# Altium schematic sheet Controller.SchDoc
size A3
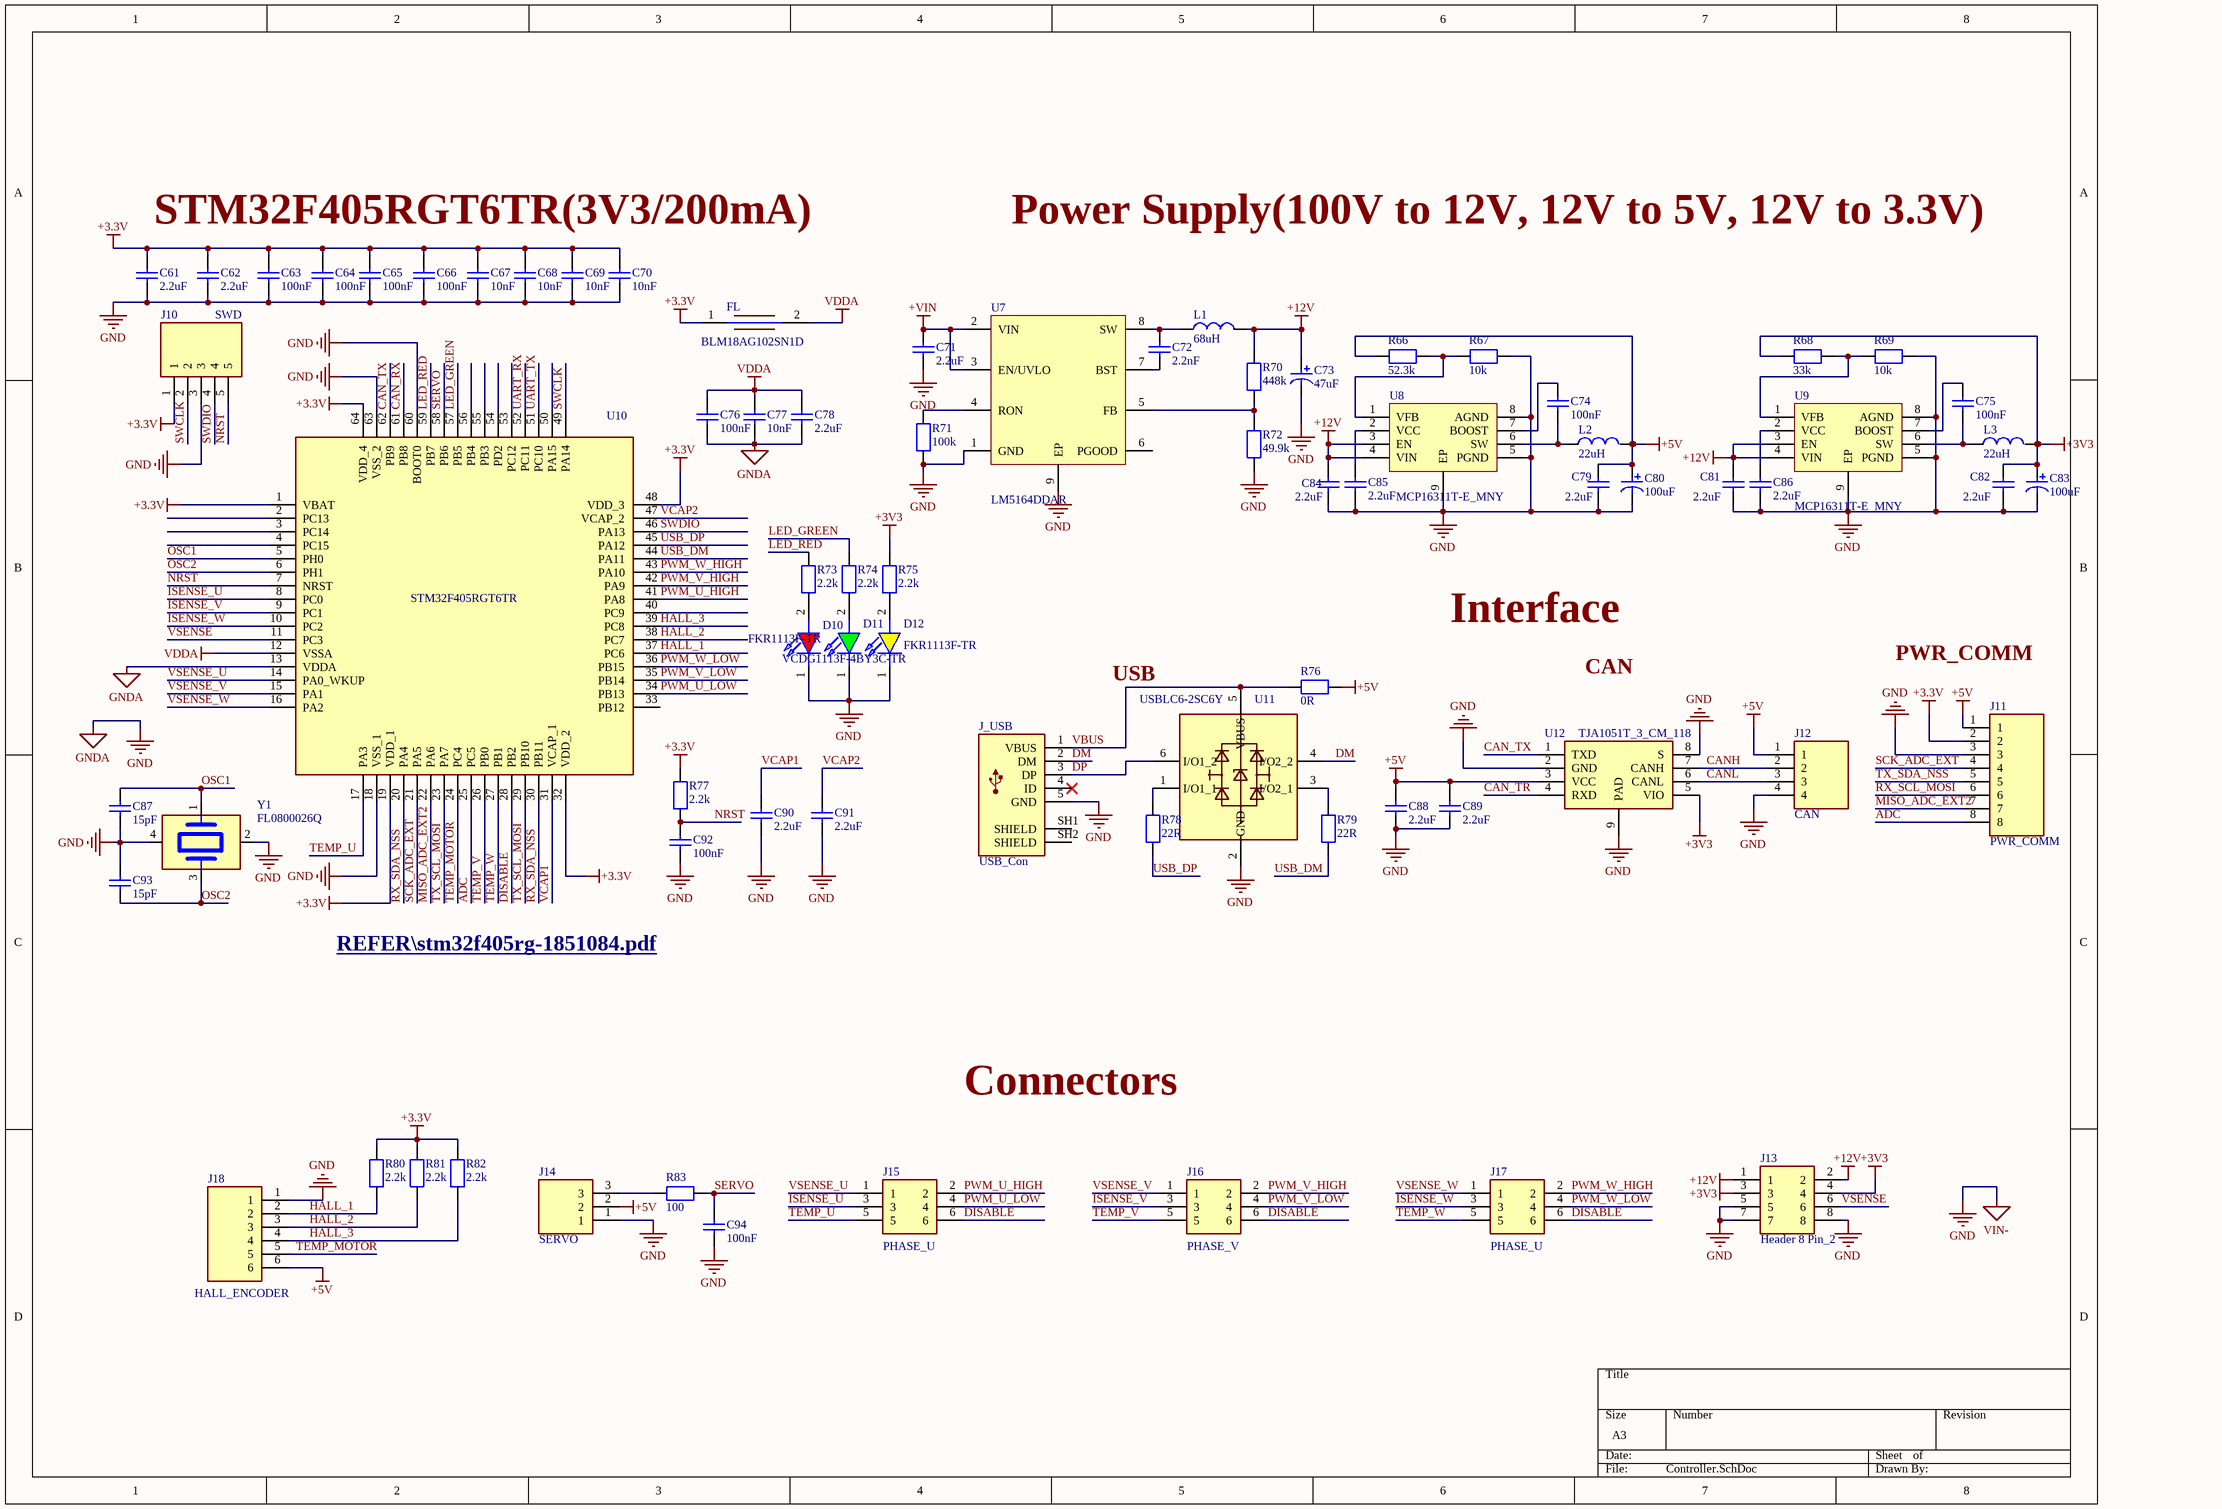
[diagram p0: Controller.SchDoc]

## Parts
C61  2.2uF  [C0603]
C62  2.2uF  [C0603]
C63  100nF  [C0402]
C64  100nF  [C0402]
C65  100nF  [C0402]
C66  100nF  [C0402]
C67  10nF  [C0402]
C68  10nF  [C0402]
C69  10nF  [C0402]
C70  10nF  [C0402]
C71  2.2uF  [C0603]
C72  2.2nF  [C0402]
C73  47uF  [CAPPRD200W52D500H1250]
C74  100nF  [C0402]
C75  100nF  [C0402]
C76  100nF  [C0402]
C77  10nF  [C0402]
C78  2.2uF  [C0603]
C79  2.2uF  [C0603]
C80  100uF  [CAPPRD225W50D680H1250]
C81  2.2uF  [C0603]
C82  2.2uF  [C0603]
C83  100uF  [CAPPRD225W50D680H1250]
C84  2.2uF  [C0603]
C85  2.2uF  [C0603]
C86  2.2uF  [C0603]
C87  15pF  [C0402]
C88  2.2uF  [C0603]
C89  2.2uF  [C0603]
C90  2.2uF  [C0603]
C91  2.2uF  [C0603]
C92  100nF  [C0402]
C93  15pF  [C0402]
C94  100nF  [C0402]
D10  FKR1113F-TR  [VCDG1113F4BY3CTR]
D11  VCDG1113F-4BY3C-TR  [VCDG1113F4BY3CTR]
D12  FKR1113F-TR  [VCDG1113F4BY3CTR]
FL  BLM18AG102SN1D  [BLM18EG121SH1D]
J10  SWD  [61300511121]
J11  PWR_COMM  [61301821121]
J12  CAN  [61300411121]
J13  Header 8 Pin_2  [61300821121]
J14  SERVO  [61300311121]
J15  PHASE_U  [61300621121]
J16  PHASE_V  [61300621121]
J17  PHASE_U  [61300621121]
J18  HALL_ENCODER  [61300611121]
J_USB  USB_Con  [10118194-0001LF]
L1  68uH  [INDPM7973X540N]
L2  22uH  [INDPM7973X540N]
L3  22uH  [INDPM7973X540N]
R66  52.3k  [R0603]
R67  10k  [R0603]
R68  33k  [R0603]
R69  10k  [R0603]
R70  448k  [R0603]
R71  100k  [R0603]
R72  49.9k  [R0603]
R73  2.2k  [R0603]
R74  2.2k  [R0603]
R75  2.2k  [R0603]
R76  0R  [R1206]
R77  2.2k  [R0603]
R78  22R  [R0603]
R79  22R  [R0603]
R80  2.2k  [R0603]
R81  2.2k  [R0603]
R82  2.2k  [R0603]
R83  100  [R0603]
U7  LM5164DDAR  [SOIC-8(EPAD)]
U8  MCP16311T-E_MNY  [MSOP-8]
U9  MCP16311T-E_MNY  [MSOP-8]
U10  STM32F405RGT6TR  [QFP50P1200X1200X160-64N]
U11  USBLC6-2SC6Y  [SOT95P280X145-6N]
U12  TJA1051T_3_CM_118  [SOIC127P600X175-8N]
Y1  FL0800026Q  [XTAL_FL0800026Q]

## Nets
+3.3V: C61.2 C62.2 C63.2 C64.2 C65.2 C66.2 C67.2 C68.2 C69.2 C70.2 FL.1 J10.1 J11.2 R77.2 R80.2 R81.2 R82.2 U10.1(VBAT) U10.19(VDD_1) U10.32(VDD_2) U10.48(VDD_3) U10.64(VDD_4)
+3V3: C82.2 C83.1 J13.3 J13.4 L3.2 R68.1 R75.2 U12.5(VIO)
+5V: C79.2 C80.1 C88.2 C89.2 J11.1 J12.1 J14.2 J18.6 L2.2 R66.1 R76.2 U12.3(VCC)
+12V: C73.1 C81.2 C84.2 J13.1 J13.2 L1.2 R70.2 U8.3(EN) U8.4(VIN) U9.3(EN) U9.4(VIN)
+VIN: C71.2 U7.2(VIN) U7.3(EN/UVLO)
GND: C61.1 C62.1 C63.1 C64.1 C65.1 C66.1 C67.1 C68.1 C69.1 C70.1 C71.1 C73.2 C76.1 C77.1 C78.1 C79.1 C80.2 C81.1 C82.1 C83.2 C84.1 C85.1 C86.1 C87.1 C88.1 C89.1 C90.1 C91.1 C92.1 C93.2 C94.1 D10.1(K) D11.1(K) D12.1(K) J10.3 J11.3 J12.4 J13.5 J13.7 J13.8 J14.1 J18.1 J_USB.5(GND) R67.2 R69.2 R71.1 R72.1 U7.1(GND) U7.9(EP) U8.5(PGND) U8.8(AGND) U8.9(EP) U9.5(PGND) U9.8(AGND) U9.9(EP) U10.13(VDDA) U10.18(VSS_1) U10.60(BOOT0) U10.63(VSS_2) U11.2(GND) U12.2(GND) U12.8(S) U12.9(PAD) Y1.2(GND) Y1.4(GND)  [also labelled GNDA, VIN-]
VDDA: C76.2 C77.2 C78.2 FL.2 U10.12(VSSA)
ADC: J11.8 U10.25(PC5)
CAN_RX: U10.61(PB8)
CAN_TR: U12.4(RXD)
CAN_TX: U10.62(PB9) U12.1(TXD)
CANH: J12.2 U12.7(CANH)
CANL: J12.3 U12.6(CANL)
DISABLE: J15.6 J16.6 J17.6 U10.28(PB2)
DM: J_USB.2(DM) U11.4(I/O2_2)
DP: J_USB.3(DP) U11.6(I/O1_2)
HALL_1: J18.2 R80.1 U10.37(PC6)
HALL_2: J18.3 R81.1 U10.38(PC7)
HALL_3: J18.4 R82.1 U10.39(PC8)
ISENSE_U: J15.3 U10.8(PC0)
ISENSE_V: J16.3 U10.9(PC1)
ISENSE_W: J17.3 U10.10(PC2)
LED_GREEN: R74.2 U10.57(PB5)
LED_RED: R73.2 U10.59(PB7)
MISO_ADC_EXT2: J11.7 U10.22(PA6)
NRST: C92.2 J10.5 R77.1 U10.7(NRST)
OSC1: C87.2 U10.5(PH0) Y1.1
OSC2: C93.1 U10.6(PH1) Y1.3
PWM_U_HIGH: J15.2 U10.41(PA8)
PWM_U_LOW: J15.4 U10.34(PB13)
PWM_V_HIGH: J16.2 U10.42(PA9)
PWM_V_LOW: J16.4 U10.35(PB14)
PWM_W_HIGH: J17.2 U10.43(PA10)
PWM_W_LOW: J17.4 U10.36(PB15)
RX_SCL_MOSI: J11.6
RX_SDA_NSS: U10.20(PA4) U10.30(PB11)
SCK_ADC_EXT: J11.4 U10.21(PA5)
SERVO: C94.2 R83.2 U10.58(PB6)
SWCLK: J10.2 U10.49(PA14)
SWDIO: J10.4 U10.46(PA13)
TEMP_MOTOR: J18.5 U10.24(PC4)
TEMP_U: J15.5 U10.17(PA3)
TEMP_V: J16.5 U10.26(PB0)
TEMP_W: J17.5 U10.27(PB1)
TX_SCL_MOSI: U10.23(PA7) U10.29(PB10)
TX_SDA_NSS: J11.5
UART_RX: U10.52(PC11)
UART_TX: U10.51(PC10)
USB_DM: R79.1 U10.44(PA11)
USB_DP: R78.1 U10.45(PA12)
VBUS: J_USB.1(VBUS) R76.1 U11.5(VBUS)
VCAP1: C90.2 U10.31(VCAP_1)
VCAP2: C91.2 U10.47(VCAP_2)
VSENSE: J13.6 U10.11(PC3)
VSENSE_U: J15.1 U10.14(PA0_WKUP)
VSENSE_V: J16.1 U10.15(PA1)
VSENSE_W: J17.1 U10.16(PA2)
NetC72_1: C72.1 U7.7(BST)
NetC72_2: C72.2 L1.1 U7.8(SW)
NetC74_1: C74.1 L2.1 U8.6(SW)
NetC74_2: C74.2 U8.7(BOOST)
NetC75_1: C75.1 L3.1 U9.6(SW)
NetC75_2: C75.2 U9.7(BOOST)
NetC85_2: C85.2 U8.2(VCC)
NetC86_2: C86.2 U9.2(VCC)
NetD10_2: D10.2(A) R73.1
NetD11_2: D11.2(A) R74.1
NetD12_2: D12.2(A) R75.1
NetJ14_3: J14.3 R83.1
NetR66_2: R66.2 R67.1 U8.1(VFB)
NetR68_2: R68.2 R69.1 U9.1(VFB)
NetR70_1: R70.1 R72.2 U7.5(FB)
NetR71_2: R71.2 U7.4(RON)
NetR78_2: R78.2 U11.1(I/O1_1)
NetR79_2: R79.2 U11.3(I/O2_1)

Not connected (* = marked no-connect by the designer): J_USB 4(ID)* SH1(SHIELD) SH2(SHIELD); U7 6(PGOOD); U10 2(PC13) 3(PC14) 4(PC15) 33(PB12) 40(PC9) 50(PA15) 53(PC12) 54(PD2) 55(PB3) 56(PB4)

## Notes on the sheet
- STM32F405RGT6TR(3V3/200mA)
- Power Supply(100V to 12V, 12V to 5V, 12V to 3.3V)
- Interface
- (near U11) USB
- CAN
- PWR_COMM
- REFER\stm32f405rg-1851084.pdf <F:\TASK\2023\8\VESC_MotorController\REFER\STM32f405rg-1851084.pdf>
- Connectors

## Library data of the parts
C61 C62 C71 C78 C79 C81 C82 C84-C86 C88-C91 = 2.2uF ± 10% 50V: Manufacturer: Yageo; Manufacturer Part Number: GRM188R61H225ME11J; Value: 2.2uF; Supplier: mouser; Supplier Part Number: 81-GRM188R61H225ME1J; Price: 0.3
C63-C66 C74-C76 C92 C94 = 100nF ± 10% 50V: Manufacturer: Yageo; Manufacturer Part Number: CS0603KRX7R9BB104; Value: 100nF; Supplier: mouser; Supplier Part Number: 603-CS0603KRX79BB104; Price: 0.1
C67-C70 C77 = 10nF ± 10% 50V: Manufacturer: Yageo; Manufacturer Part Number: CS0603KRX79BB103; Value: 10nF; Supplier: mouser; Supplier Part Number: 603-CS0603KRX79BB103; Price: 0.1
C72 = 2.2nF ± 10% 50V: Manufacturer: Yageo; Manufacturer Part Number: CS0603KRX79BB222; Value: 2.2nF; Supplier: mouser; Supplier Part Number: 603-CS0603KRX79BB222; Price: 0.1
C73 = 47uF ± 10% 25V: Manufacturer: Wurth Electronic; Manufacturer Part Number: 860040472001; Value: 47uF; Supplier: mouser; Supplier Part Number: 710-860040472001; Price: 0.18
C80 C83 = 100uF ± 10% 25V: Manufacturer: Lelon; Manufacturer Part Number: RGA101M1EBK-0611G; Value: 100uF; Supplier: mouser; Supplier Part Number: 140-RGA101M1EBK0611G; Price: 0.17
C87 C93 = 15pF ± 10% 50V: Manufacturer: Yageo; Manufacturer Part Number: CS0603KRX79BB150; Value: 15pF; Supplier: mouser; Supplier Part Number: 603-CS0603KRX79BB150; Price: 0.1
D10 = LED_RED: R/A LED; Manufacturer: Stanley Electric; Value: Red; Supplier Part Number: 327-FKR1113FTR; Supplier: Mouser; Manufacturer Part Number: FKR1113F-TR; Price: 0.78
D11 = LED_GREEN: R/A LED; Manufacturer: Stanley Electric; Value: Green; Supplier Part Number: 327-VCDG1113F4BY3CTR; Supplier: Mouser; Manufacturer Part Number: VCDG1113F-4BY3C-TR; Price: 0.78
D12 = LED_YELLOW: R/A LED; Manufacturer: Stanley Electric; Manufacturer Part Number: FKY1113F-TR; Value: Yellow; Supplier Part Number: 327-FKY1113FTR; Supplier: Mouser; Price: 0.78
FL = BLM18AG102SN1D: Ferrite Beads 1000 OHM 25% Alternate Sizing Guide Below; Manufacturer: Murata; Manufacturer Part Number: BLM18AG102SN1D; Price: 0.15; Supplier Part Number: 81-BLM11A102S; Value: BLM18AG102SN1D; Supplier: Mouser
J10 = Header 5 Pin: Headers & Wire Housings WR-PHD 2.54mm Hdr 5P Single Str Gold; Manufacturer: Wurth Electronic; Value: 61300511121; Supplier Part Number: 710-61300511121; Supplier: Mouser; Manufacturer Part Number: 61300511121; Price: 0.37
J11 = Header 8 Pin: Headers & Wire Housings WR-PHD 2.54mm Hdr 8P Single Str Gold; Manufacturer: Wurth Electronic; Manufacturer Part Number: 61300811121; Value: 61300811121; Supplier Part Number: 710-61300811121; Supplier: Mouser; Price: 0.4
J12 = Header 4 Pin: Headers & Wire Housings WR-PHD 2.54mm Hdr 4P Single Str Gold; Manufacturer: Wurth Electronic; Value: 61300411121; Supplier Part Number: 710-61300411121; Supplier: Mouser; Manufacturer Part Number: 61300411121; Price: 0.27
J13 = Header 8 Pin_2: Headers & Wire Housings WR-PHD 2.54mm Hdr 8P Dual Str Gold; Manufacturer: Wurth Elektronik; Value: 61300821121; Supplier Part Number: 710-61300621121; Supplier: Mouser; Manufacturer Part Number: 61300821121; Price: 0.7
J14 = Header 3 Pin: Headers & Wire Housings WR-PHD 2.54mm Hdr 3P Single Str Gold; Manufacturer: Wurth Electronic; Value: 61300311121; Supplier Part Number: 710-61300311121; Supplier: Mouser; Manufacturer Part Number: 61300311121; Price: 0.13
J15-J17 = Header 6 Pin_2: WR-PHD 2.54mm  Dual Pin Header THT 06p Wurth Elektronik WR-PHD Series, Series Number 6130, 2.54mm Pitch 6 Way 2 Row Straight PCB Header, Solder Termination; Value: 61300621121; Supplier Part Number: 710-61300621121; Supplier: Mouser; Manufacturer: Wurth Elektronik; Manufacturer Part Number: 61300621121; Price: 0.57
J18 = Header 6 Pin: Headers & Wire Housings WR-PHD 2.54mm Hdr 5P Single Str Gold; Manufacturer: Wurth Electronic; Value: 61300611121; Supplier Part Number: 710-61300611121; Supplier: Mouser; Manufacturer Part Number: 61300611121; Price: 0.35
J_USB = USB_Con: USB - micro B USB 2.0 Receptacle Connector 5 Position Through Hole; Manufacturer Part Number: 614105150721; Manufacturer: Wurth Electronics; Value: 614105150721; Price: 3; Supplier Part Number: 710-614105150721; Supplier: Mouser
L1 = SRP7050WA-680M: Ind,7.9x7.3x5.2mm,68uH+/-20%,2.7A,shd; Manufacturer: Bourns; Geometry.Height: 5.4mm; Supplier Part Number: 652-SRP7050WA-680M; Supplier: Mouser; Manufacturer Part Number: SRP7050WA-680M; Price: 1.46; Value: 68uH
L2 L3 = SRP7050WA-220M: Ind,7.9x7.3x5.2mm,22uH+/-20%,5A,shd; Manufacturer: Bourns; Supplier Part Number: 652-SRP7050WA-220M; Supplier: Mouser; Manufacturer Part Number: SRP7050WA-220M; Price: 1.46; Value: 22uH
R66 = 52.3 kOhms ±1% 0.1W: Manufacturer: Yageo; Manufacturer Part Number: RC0603FR-0752K3L; Value: 52.3k; Supplier: mouser; Supplier Part Number: 603-RC0603FR-0752K3L; Price: 0.1
R67 R69 = 10 kOhms ±1% 0.1W: Manufacturer: Yageo; Manufacturer Part Number: RC0603FR-0710KL; Value: 10k; Supplier: mouser; Supplier Part Number: 603-RC0603FR-0710KL; Price: 0.1
R68 = 33 kOhms ±1% 0.1W: Manufacturer: Yageo; Manufacturer Part Number: RC0603FR-0733KL; Value: 33k; Supplier: mouser; Supplier Part Number: 603-RC0603FR-0733KL; Price: 0.1
R70 = 448 kOhms ±1% 0.1W: Manufacturer: Yageo; Manufacturer Part Number: RC0603FR-07448KL; Value: 448k; Supplier: mouser; Supplier Part Number: 603-RC0603FR-07448KL; Price: 0.1
R71 = 100 kOhms ±1% 0.1W: Manufacturer: Yageo; Manufacturer Part Number: RC0603FR-07100KL; Value: 100k; Supplier: mouser; Supplier Part Number: 603-RC0603FR-07100KL; Price: 0.1
R72 = 49.9 kOhms ±1% 0.1W: Manufacturer: Yageo; Manufacturer Part Number: RC0603FR-0749K9L; Value: 49.9k; Supplier: mouser; Supplier Part Number: 603-RC0603FR-0749K9L; Price: 0.1
R73-R75 R77 R80-R82 = 2.2 kOhms ±1% 0.1W: Manufacturer: Yageo; Manufacturer Part Number: RC0603FR-072K2L; Value: 2.2k; Supplier: Mouser; Supplier Part Number: 603-RC0603FR-072K2L; Price: 0.1
R76 = 0ohm 0.25W ±1%: 0 ohm 0.25W ±1%; Manufacturer Part Number: RC1206FR-070RL; Manufacturer: Yageo; Value: 0R; Supplier Part Number: 603-RC1206FR-070RL
R78 R79 = 22ohm 0.1W ±1%: 22 ohm 0.1W ±1%; Manufacturer Part Number: RC0603FR-0722RL; Manufacturer: Yageo; Value: 22R; Supplier: Mouser; Supplier Part Number: 603-RC0603FR-0722RL; Price: 0.1
R83 = 100 Ohms ±1% 0.1W: Manufacturer: Yageo; Manufacturer Part Number: RC0603FR-0710KL; Value: 100; Supplier: mouser; Supplier Part Number: 603-RC0603FR-0710KL; Price: 0.1
U7 = LM5164DDAR: Texas Instruments 6-V to 100-V Input, 1-A Synchronous Buck DC-DC Converter With Ultra-Low IQ 8-SO PowerPAD -40 to 150; Value: 1.7mm; Supplier Part Number: 595-LM5164DDAR; Price: 3.5; Manufacturer: Texas Instruments; Manufacturer Part Number: LM5164DDAR; Supplier: Mouser
U8 U9 = MCP16311T-E_MNY: Microchip, MCP16311T-E/MNY Step Down DC-DC Converter 1A Adjustable, 2  24 V 8-Pin, TDFN; Supplier Part Number: 579-MCP16311T-E/MNY; Price: 1.8; Manufacturer: Microchip; Manufacturer Part Number: MCP16311T-E/MNY; Value: MCP16311T-E/MNY; Supplier: Mouser
U10 = STM32F405RGT6TR: STM32F405RGT6TR, 32 bit ARM Cortex M4 MCU 168MHz 1024 kB Flash, 192 kB RAM, 2xUSB CAN I2C 64-Pin LQFP; Manufacturer_Name: STMicroelectronics; Geometry.Height: 1.6mm; Mouser Part Number: 511-STM32F405RGT6TR; Mouser Price/Stock: https://www.mouser.co.uk/ProductDetail/STMicroelectronics/STM32F405RGT6TR?qs=MavH1QghrkHshpR6GkvPIg%3D%3D; Manufacturer_Part_Number: STM32F405RGT6TR; Datasheet Link: http://www.st.com/web/en/resource/technical/document/datasheet/DM00037051.pdf
U11 = USBLC6-2SC6Y: Low Cap. ESD Protection Auto SOT-23-6 STMicroelectronics USBLC6-2SC6Y, Dual Uni-Directional TVS Diode Array, 6-Pin SOT-23; Supplier Part Number: 511-USBLC6-2SC6Y; Supplier: Mouser; Manufacturer Part Number: USBLC6-2SC6Y; Price: 1.45; Manufacturer: STMicroelectronics; Value: USBLC6-2SC6Y
U12 = TJA1051T_3_CM_118: CAN Interface IC BL Advanced Automotive Analog; Manufacturer: NXP Semiconductors; Manufacturer Part Number: TJA1051T/3/CM,118; Value: TJA1051T/3/CM,118; Supplier Part Number: 771-TJA1051T/3CM118; Supplier: Mouser; Price: 1.6
Y1 = FL0800026Q: 8 MHz A±30ppm Crystals Crystal Ceramic SEAM3225 T&R 3K; Manufacturer: Diodes Incorporated; Value: 8MHz; Price: 0.5; Supplier: Mouser; Manufacturer Part Number: FL0800026Q; Supplier Part Number: 621-FL0800026Q